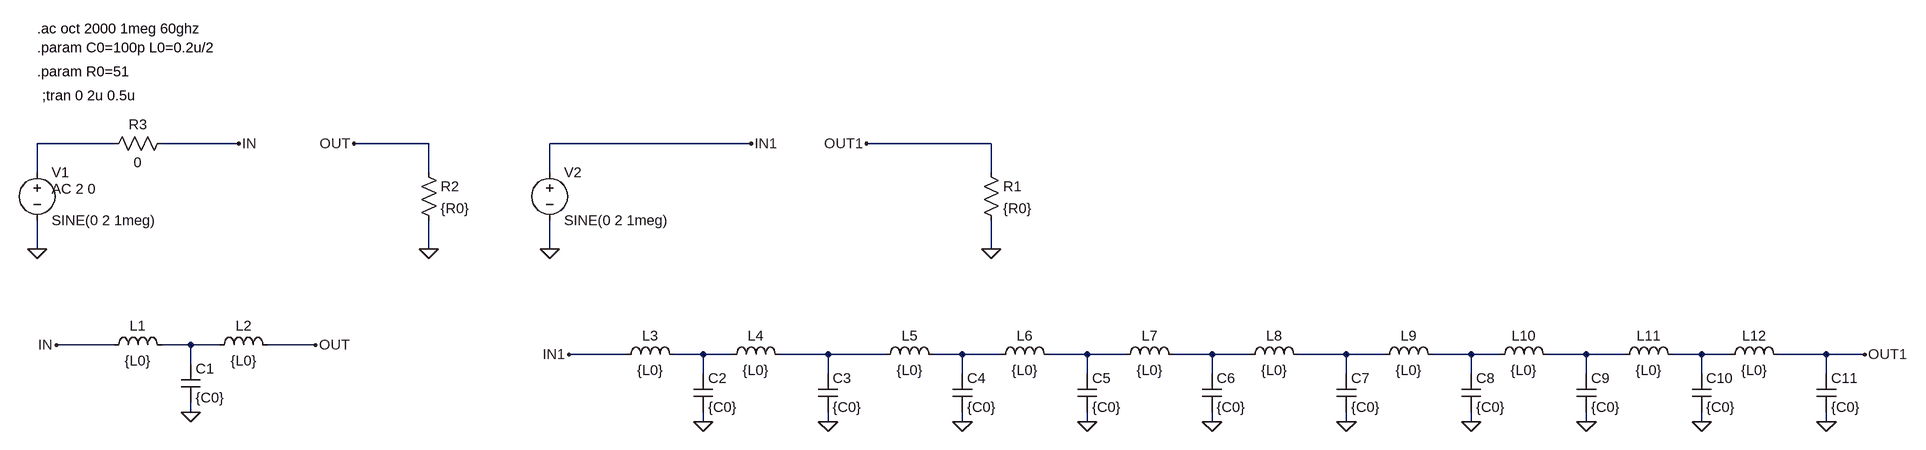
[diagram p0: schematic waka_AC.asc]
waka_AC.asc, the LTspice schematic file:
Version 4
SHEET 1 3472 1412
WIRE -96 -160 -224 -160
WIRE 112 -160 -16 -160
WIRE 512 -160 304 -160
WIRE 1536 -160 1200 -160
WIRE 1936 -160 1728 -160
WIRE -224 -112 -224 -160
WIRE 512 -112 512 -160
WIRE 1200 -112 1200 -160
WIRE 1936 -112 1936 -160
WIRE -224 16 -224 -32
WIRE 512 16 512 -32
WIRE 1200 16 1200 -32
WIRE 1936 16 1936 -32
WIRE -96 176 -192 176
WIRE 32 176 -16 176
WIRE 80 176 32 176
WIRE 240 176 160 176
WIRE 1328 192 1232 192
WIRE 1456 192 1408 192
WIRE 1504 192 1456 192
WIRE 1664 192 1584 192
WIRE 1760 192 1664 192
WIRE 1888 192 1840 192
WIRE 1952 192 1888 192
WIRE 2096 192 2032 192
WIRE 2160 192 2096 192
WIRE 2304 192 2240 192
WIRE 2368 192 2304 192
WIRE 2528 192 2448 192
WIRE 2592 192 2528 192
WIRE 2736 192 2672 192
WIRE 2784 192 2736 192
WIRE 2928 192 2864 192
WIRE 2992 192 2928 192
WIRE 3120 192 3072 192
WIRE 3168 192 3120 192
WIRE 3328 192 3248 192
WIRE 3392 192 3328 192
WIRE 32 208 32 176
WIRE 1456 224 1456 192
WIRE 1664 224 1664 192
WIRE 1888 224 1888 192
WIRE 2096 224 2096 192
WIRE 2304 224 2304 192
WIRE 2528 224 2528 192
WIRE 2736 224 2736 192
WIRE 2928 224 2928 192
WIRE 3120 224 3120 192
WIRE 3328 224 3328 192
WIRE 32 288 32 272
WIRE 1456 304 1456 288
WIRE 1664 304 1664 288
WIRE 1888 304 1888 288
WIRE 2096 304 2096 288
WIRE 2304 304 2304 288
WIRE 2528 304 2528 288
WIRE 2736 304 2736 288
WIRE 2928 304 2928 288
WIRE 3120 304 3120 288
WIRE 3328 304 3328 288
FLAG 32 288 0
FLAG -192 176 IN
FLAG 240 176 OUT
FLAG -224 16 0
FLAG 112 -160 IN
FLAG 512 16 0
FLAG 304 -160 OUT
FLAG 1456 304 0
FLAG 1232 192 IN1
FLAG 1664 304 0
FLAG 1888 304 0
FLAG 2096 304 0
FLAG 2304 304 0
FLAG 2528 304 0
FLAG 2736 304 0
FLAG 2928 304 0
FLAG 3120 304 0
FLAG 3392 192 OUT1
FLAG 1200 16 0
FLAG 1536 -160 IN1
FLAG 1936 16 0
FLAG 1728 -160 OUT1
FLAG 3328 304 0
SYMBOL ind -112 192 R270
WINDOW 0 32 56 VTop 2
WINDOW 3 5 56 VBottom 2
SYMATTR InstName L1
SYMATTR Value {L0}
SYMBOL ind 64 192 R270
WINDOW 0 32 56 VTop 2
WINDOW 3 5 56 VBottom 2
SYMATTR InstName L2
SYMATTR Value {L0}
SYMBOL cap 16 208 R0
SYMATTR InstName C1
SYMATTR Value {C0}
SYMBOL res 496 -128 R0
SYMATTR InstName R2
SYMATTR Value {R0}
SYMBOL ind 1312 208 R270
WINDOW 0 32 56 VTop 2
WINDOW 3 5 56 VBottom 2
SYMATTR InstName L3
SYMATTR Value {L0}
SYMBOL ind 1488 208 R270
WINDOW 0 32 56 VTop 2
WINDOW 3 5 56 VBottom 2
SYMATTR InstName L4
SYMATTR Value {L0}
SYMBOL cap 1440 224 R0
SYMATTR InstName C2
SYMATTR Value {C0}
SYMBOL ind 1744 208 R270
WINDOW 0 32 56 VTop 2
WINDOW 3 5 56 VBottom 2
SYMATTR InstName L5
SYMATTR Value {L0}
SYMBOL ind 1936 208 R270
WINDOW 0 32 56 VTop 2
WINDOW 3 5 56 VBottom 2
SYMATTR InstName L6
SYMATTR Value {L0}
SYMBOL ind 2144 208 R270
WINDOW 0 32 56 VTop 2
WINDOW 3 5 56 VBottom 2
SYMATTR InstName L7
SYMATTR Value {L0}
SYMBOL ind 2352 208 R270
WINDOW 0 32 56 VTop 2
WINDOW 3 5 56 VBottom 2
SYMATTR InstName L8
SYMATTR Value {L0}
SYMBOL ind 2576 208 R270
WINDOW 0 32 56 VTop 2
WINDOW 3 5 56 VBottom 2
SYMATTR InstName L9
SYMATTR Value {L0}
SYMBOL ind 2768 208 R270
WINDOW 0 32 56 VTop 2
WINDOW 3 5 56 VBottom 2
SYMATTR InstName L10
SYMATTR Value {L0}
SYMBOL ind 2976 208 R270
WINDOW 0 32 56 VTop 2
WINDOW 3 5 56 VBottom 2
SYMATTR InstName L11
SYMATTR Value {L0}
SYMBOL ind 3152 208 R270
WINDOW 0 32 56 VTop 2
WINDOW 3 5 56 VBottom 2
SYMATTR InstName L12
SYMATTR Value {L0}
SYMBOL cap 1648 224 R0
SYMATTR InstName C3
SYMATTR Value {C0}
SYMBOL cap 1872 224 R0
SYMATTR InstName C4
SYMATTR Value {C0}
SYMBOL cap 2080 224 R0
SYMATTR InstName C5
SYMATTR Value {C0}
SYMBOL cap 2288 224 R0
SYMATTR InstName C6
SYMATTR Value {C0}
SYMBOL cap 2512 224 R0
SYMATTR InstName C7
SYMATTR Value {C0}
SYMBOL cap 2720 224 R0
SYMATTR InstName C8
SYMATTR Value {C0}
SYMBOL cap 2912 224 R0
SYMATTR InstName C9
SYMATTR Value {C0}
SYMBOL cap 3104 224 R0
SYMATTR InstName C10
SYMATTR Value {C0}
SYMBOL voltage -224 -128 R0
WINDOW 123 24 44 Left 2
WINDOW 39 0 0 Left 0
SYMATTR InstName V1
SYMATTR Value SINE(0 2 1meg)
SYMATTR Value2 AC 2 0
SYMBOL res 1920 -128 R0
SYMATTR InstName R1
SYMATTR Value {R0}
SYMBOL voltage 1200 -128 R0
WINDOW 123 0 0 Left 0
WINDOW 39 0 0 Left 0
SYMATTR InstName V2
SYMATTR Value SINE(0 2 1meg)
SYMBOL cap 3312 224 R0
SYMATTR InstName C11
SYMATTR Value {C0}
SYMBOL res 0 -176 R90
WINDOW 0 0 56 VBottom 2
WINDOW 3 32 56 VTop 2
SYMATTR InstName R3
SYMATTR Value 0
TEXT -224 -352 Left 2 !.ac oct 2000 1meg 60ghz
TEXT -224 -320 Left 2 !.param C0=100p L0=0.2u/2
TEXT -224 -280 Left 2 !.param R0=51
TEXT -216 -240 Left 2 !;tran 0 2u 0.5u

The netlist it stands for:
* waka_AC.asc
L1 IN N002 {L0}
L2 N002 OUT {L0}
C1 N002 0 {C0}
R2 OUT 0 {R0}
L3 IN1 N003 {L0}
L4 N003 N004 {L0}
C2 N003 0 {C0}
L5 N004 N005 {L0}
L6 N005 N006 {L0}
L7 N006 N007 {L0}
L8 N007 N008 {L0}
L9 N008 N009 {L0}
L10 N009 N010 {L0}
L11 N010 N011 {L0}
L12 N011 OUT1 {L0}
C3 N004 0 {C0}
C4 N005 0 {C0}
C5 N006 0 {C0}
C6 N007 0 {C0}
C7 N008 0 {C0}
C8 N009 0 {C0}
C9 N010 0 {C0}
C10 N011 0 {C0}
V1 N001 0 SINE(0 2 1meg) AC 2 0
R1 OUT1 0 {R0}
V2 IN1 0 SINE(0 2 1meg)
C11 OUT1 0 {C0}
R3 IN N001 0
.ac oct 2000 1meg 60ghz
.param C0=100p L0=0.2u/2
.param R0=51
;tran 0 2u 0.5u
.backanno
.end